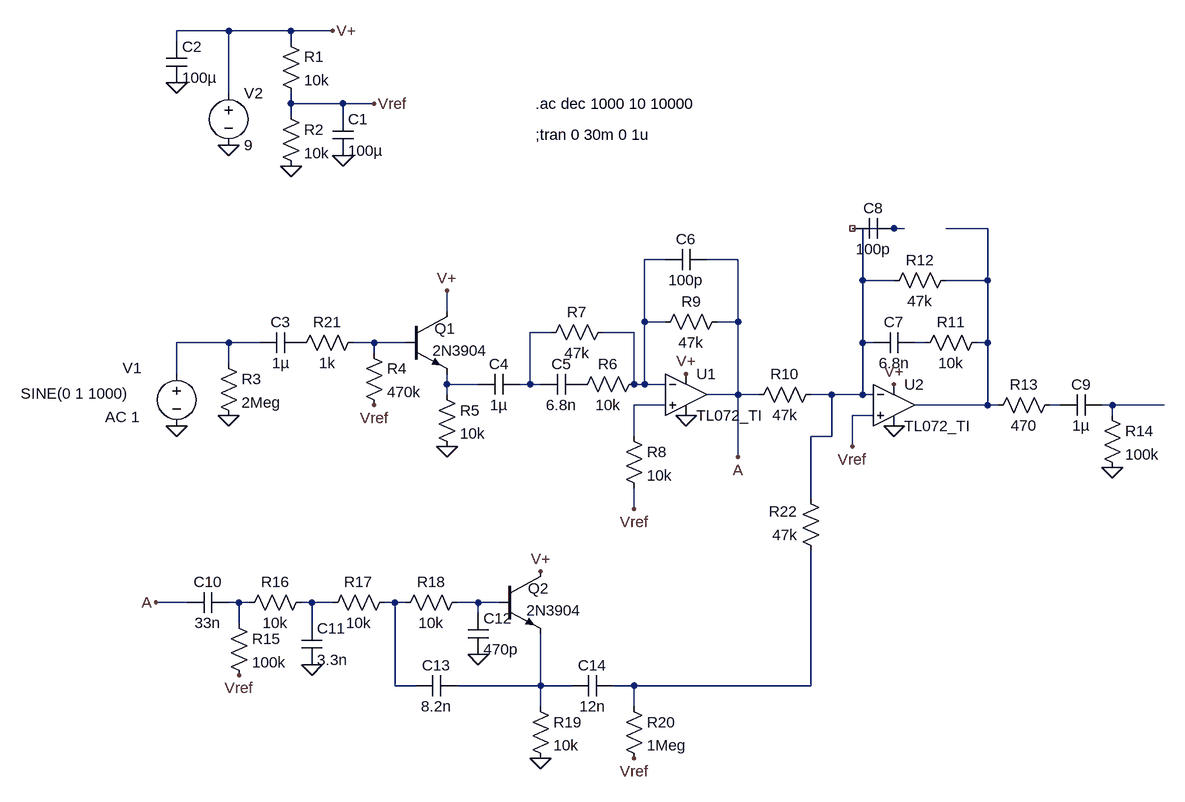
[diagram p0: schematic ehx_small_clone.asc]
ehx_small_clone.asc, the LTspice schematic file:
Version 4
SHEET 1 1620 864
WIRE 176 -352 96 -352
WIRE 272 -352 176 -352
WIRE 336 -352 272 -352
WIRE 96 -336 96 -352
WIRE 272 -336 272 -352
WIRE 176 -256 176 -352
WIRE 272 -240 272 -256
WIRE 352 -240 272 -240
WIRE 400 -240 352 -240
WIRE 272 -224 272 -240
WIRE 352 -224 352 -240
WIRE 1200 -48 1152 -48
WIRE 1216 -48 1200 -48
WIRE 1344 -48 1280 -48
WIRE 848 0 816 0
WIRE 960 0 912 0
WIRE 1152 32 1152 -48
WIRE 1200 32 1152 32
WIRE 1344 32 1344 -48
WIRE 1344 32 1280 32
WIRE 512 80 512 48
WIRE 816 96 816 0
WIRE 848 96 816 96
WIRE 960 96 960 0
WIRE 960 96 928 96
WIRE 672 112 640 112
WIRE 800 112 752 112
WIRE 176 128 96 128
WIRE 224 128 176 128
WIRE 400 128 368 128
WIRE 448 128 400 128
WIRE 1152 128 1152 32
WIRE 1168 128 1152 128
WIRE 1248 128 1232 128
WIRE 1344 128 1344 32
WIRE 1344 128 1328 128
WIRE 400 144 400 128
WIRE 176 160 176 128
WIRE 96 176 96 128
WIRE 512 192 512 176
WIRE 560 192 512 192
WIRE 640 192 640 112
WIRE 640 192 624 192
WIRE 656 192 640 192
WIRE 800 192 800 112
WIRE 816 192 816 96
WIRE 816 192 800 192
WIRE 848 192 816 192
WIRE 512 208 512 192
WIRE 960 208 960 96
WIRE 960 208 912 208
WIRE 992 208 960 208
WIRE 1104 208 1072 208
WIRE 1152 208 1152 128
WIRE 1152 208 1104 208
WIRE 1168 208 1152 208
WIRE 848 224 800 224
WIRE 1344 224 1344 128
WIRE 1344 224 1232 224
WIRE 1360 224 1344 224
WIRE 1456 224 1440 224
WIRE 1536 224 1520 224
WIRE 1616 224 1536 224
WIRE 1168 240 1136 240
WIRE 1536 240 1536 224
WIRE 800 272 800 224
WIRE 1104 272 1104 208
WIRE 1104 272 1072 272
WIRE 1136 288 1136 240
WIRE 960 304 960 208
WIRE 1072 368 1072 272
WIRE 800 384 800 352
WIRE 112 528 64 528
WIRE 192 528 176 528
WIRE 208 528 192 528
WIRE 304 528 288 528
WIRE 336 528 304 528
WIRE 432 528 416 528
WIRE 448 528 432 528
WIRE 560 528 528 528
WIRE 592 528 560 528
WIRE 560 544 560 528
WIRE 192 560 192 528
WIRE 304 560 304 528
WIRE 432 656 432 528
WIRE 464 656 432 656
WIRE 656 656 656 576
WIRE 656 656 528 656
WIRE 704 656 656 656
WIRE 800 656 768 656
WIRE 1072 656 1072 448
WIRE 1072 656 800 656
WIRE 656 688 656 656
WIRE 800 688 800 656
FLAG 96 256 0
FLAG 176 -176 0
FLAG 272 -144 0
FLAG 96 -272 0
FLAG 352 -160 0
FLAG 336 -352 V+
FLAG 400 -240 Vref
FLAG 512 48 V+
FLAG 176 240 0
FLAG 512 288 0
FLAG 880 176 V+
FLAG 880 240 0
FLAG 800 384 Vref
FLAG 1200 192 V+
FLAG 1200 256 0
FLAG 1136 288 Vref
FLAG 1536 320 0
FLAG 400 224 Vref
FLAG 560 608 0
FLAG 656 768 0
FLAG 304 624 0
FLAG 192 640 Vref
FLAG 656 480 V+
FLAG 64 528 A
FLAG 960 304 A
FLAG 800 768 Vref
SYMBOL voltage 96 160 R0
WINDOW 0 -83 7 Left 2
WINDOW 3 -240 46 Left 2
WINDOW 123 -110 82 Left 2
WINDOW 39 0 0 Left 2
SYMATTR InstName V1
SYMATTR Value SINE(0 1 1000)
SYMATTR Value2 AC 1
SYMBOL voltage 176 -272 R0
WINDOW 123 0 0 Left 2
WINDOW 39 0 0 Left 2
SYMATTR InstName V2
SYMATTR Value 9
SYMBOL res 256 -352 R0
SYMATTR InstName R1
SYMATTR Value 10k
SYMBOL res 256 -240 R0
SYMATTR InstName R2
SYMATTR Value 10k
SYMBOL cap 336 -224 R0
SYMATTR InstName C1
SYMATTR Value 100µ
SYMBOL cap 80 -336 R0
SYMATTR InstName C2
SYMATTR Value 100µ
SYMBOL EXTRA\\AudioOpamp\\TI\\TL072_TI 880 208 R0
SYMATTR InstName U1
SYMBOL EXTRA\\AudioOpamp\\TI\\TL072_TI 1200 224 R0
SYMATTR InstName U2
SYMBOL res 160 144 R0
SYMATTR InstName R3
SYMATTR Value 2Meg
SYMBOL cap 288 112 R90
WINDOW 0 0 32 VBottom 2
WINDOW 3 32 32 VTop 2
SYMATTR InstName C3
SYMATTR Value 1µ
SYMBOL res 384 128 R0
SYMATTR InstName R4
SYMATTR Value 470k
SYMBOL npn 448 80 R0
WINDOW 0 45 26 Left 2
WINDOW 3 42 60 Left 2
SYMATTR InstName Q1
SYMATTR Value 2N3904
SYMBOL res 496 192 R0
SYMATTR InstName R5
SYMATTR Value 10k
SYMBOL cap 624 176 R90
WINDOW 0 0 32 VBottom 2
WINDOW 3 32 32 VTop 2
SYMATTR InstName C4
SYMATTR Value 1µ
SYMBOL cap 720 176 R90
WINDOW 0 0 32 VBottom 2
WINDOW 3 32 32 VTop 2
SYMATTR InstName C5
SYMATTR Value 6.8n
SYMBOL res 816 176 R90
WINDOW 0 0 56 VBottom 2
WINDOW 3 32 56 VTop 2
SYMATTR InstName R6
SYMATTR Value 10k
SYMBOL res 768 96 R90
WINDOW 0 0 56 VBottom 2
WINDOW 3 32 56 VTop 2
SYMATTR InstName R7
SYMATTR Value 47k
SYMBOL res 784 256 R0
SYMATTR InstName R8
SYMATTR Value 10k
SYMBOL res 944 80 R90
WINDOW 0 0 56 VBottom 2
WINDOW 3 32 56 VTop 2
SYMATTR InstName R9
SYMATTR Value 47k
SYMBOL cap 912 -16 R90
WINDOW 0 0 32 VBottom 2
WINDOW 3 32 32 VTop 2
SYMATTR InstName C6
SYMATTR Value 100p
SYMBOL res 1088 192 R90
WINDOW 0 0 56 VBottom 2
WINDOW 3 32 56 VTop 2
SYMATTR InstName R10
SYMATTR Value 47k
SYMBOL cap 1232 112 R90
WINDOW 0 0 32 VBottom 2
WINDOW 3 32 32 VTop 2
SYMATTR InstName C7
SYMATTR Value 6.8n
SYMBOL res 1344 112 R90
WINDOW 0 0 56 VBottom 2
WINDOW 3 32 56 VTop 2
SYMATTR InstName R11
SYMATTR Value 10k
SYMBOL res 1296 16 R90
WINDOW 0 0 56 VBottom 2
WINDOW 3 32 56 VTop 2
SYMATTR InstName R12
SYMATTR Value 47k
SYMBOL cap 1200 -64 R90
WINDOW 0 0 32 VBottom 2
WINDOW 3 32 32 VTop 2
SYMATTR InstName C8
SYMATTR Value 100p
SYMBOL res 1456 208 R90
WINDOW 0 0 56 VBottom 2
WINDOW 3 32 56 VTop 2
SYMATTR InstName R13
SYMATTR Value 470
SYMBOL cap 1520 208 R90
WINDOW 0 0 32 VBottom 2
WINDOW 3 32 32 VTop 2
SYMATTR InstName C9
SYMATTR Value 1µ
SYMBOL res 1520 224 R0
SYMATTR InstName R14
SYMATTR Value 100k
SYMBOL cap 176 512 R90
WINDOW 0 0 32 VBottom 2
WINDOW 3 32 32 VTop 2
SYMATTR InstName C10
SYMATTR Value 33n
SYMBOL res 176 544 R0
SYMATTR InstName R15
SYMATTR Value 100k
SYMBOL res 304 512 R90
WINDOW 0 0 56 VBottom 2
WINDOW 3 32 56 VTop 2
SYMATTR InstName R16
SYMATTR Value 10k
SYMBOL cap 288 560 R0
SYMATTR InstName C11
SYMATTR Value 3.3n
SYMBOL res 432 512 R90
WINDOW 0 0 56 VBottom 2
WINDOW 3 32 56 VTop 2
SYMATTR InstName R17
SYMATTR Value 10k
SYMBOL res 544 512 R90
WINDOW 0 0 56 VBottom 2
WINDOW 3 32 56 VTop 2
SYMATTR InstName R18
SYMATTR Value 10k
SYMBOL cap 544 544 R0
SYMATTR InstName C12
SYMATTR Value 470p
SYMBOL npn 592 480 R0
WINDOW 0 45 26 Left 2
WINDOW 3 42 60 Left 2
SYMATTR InstName Q2
SYMATTR Value 2N3904
SYMBOL res 640 672 R0
SYMATTR InstName R19
SYMATTR Value 10k
SYMBOL cap 528 640 R90
WINDOW 0 0 32 VBottom 2
WINDOW 3 32 32 VTop 2
SYMATTR InstName C13
SYMATTR Value 8.2n
SYMBOL res 384 112 R90
WINDOW 0 0 56 VBottom 2
WINDOW 3 32 56 VTop 2
SYMATTR InstName R21
SYMATTR Value 1k
SYMBOL cap 768 640 R90
WINDOW 0 0 32 VBottom 2
WINDOW 3 32 32 VTop 2
SYMATTR InstName C14
SYMATTR Value 12n
SYMBOL res 784 672 R0
SYMATTR InstName R20
SYMATTR Value 1Meg
SYMBOL res 1088 464 R180
WINDOW 0 36 76 Left 2
WINDOW 3 36 40 Left 2
SYMATTR InstName R22
SYMATTR Value 47k
TEXT 648 -240 Left 2 !.ac dec 1000 10 10000
TEXT 648 -192 Left 2 !;tran 0 30m 0 1u

The netlist it stands for:
* ehx_small_clone.asc
V1 N005 0 SINE(0 1 1000) AC 1
V2 V+ 0 9
R1 V+ Vref 10k
R2 Vref 0 10k
C1 Vref 0 100µ
C2 V+ 0 100µ
* U1: TL072_TI (symbol EXTRA\AudioOpamp\TI\TL072_TI not available, pins judged from their places): In+=N009 In-=N003 V+=V+ V-=0 OUT=A
* U2: TL072_TI (symbol EXTRA\AudioOpamp\TI\TL072_TI not available, pins judged from their places): In+=Vref In-=N001 V+=V+ V-=0 OUT=N002
R3 N005 0 2Meg
C3 P001 N005 1µ
R4 N006 Vref 470k
Q1 V+ N006 N008 0 2N3904
R5 N008 0 10k
C4 N004 N008 1µ
C5 P002 N004 6.8n
R6 N003 P002 10k
R7 N003 N004 47k
R8 N009 Vref 10k
R9 A N003 47k
C6 A N003 100p
R10 N001 A 47k
C7 N007 N001 6.8n
R11 N002 N007 10k
R12 N002 N001 47k
C8 N001 NC_01 100p
R13 N010 N002 470
C9 N011 N010 1µ
R14 N011 0 100k
C10 N012 A 33n
R15 N012 Vref 100k
R16 N013 N012 10k
C11 N013 0 3.3n
R17 N014 N013 10k
R18 N015 N014 10k
C12 N015 0 470p
Q2 V+ N015 N016 0 2N3904
R19 N016 0 10k
C13 N016 N014 8.2n
R21 N006 P001 1k
C14 N017 N016 12n
R20 N017 Vref 1Meg
R22 N017 N001 47k
.model NPN NPN
.model PNP PNP
.lib standard.bjt
.ac dec 1000 10 10000
;tran 0 30m 0 1u
.backanno
.end